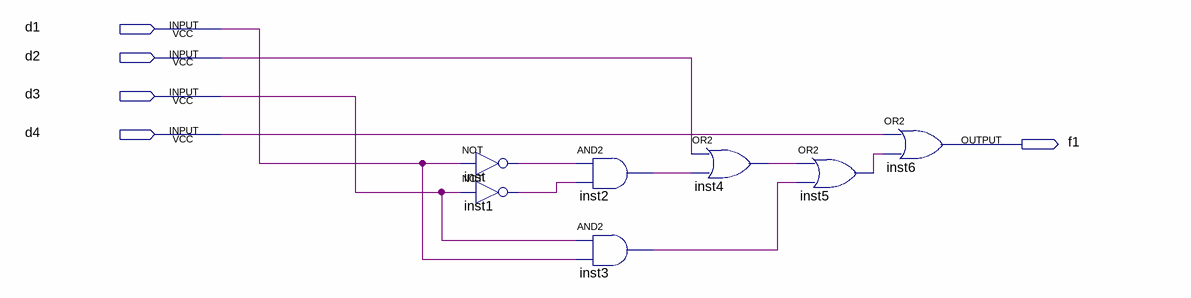
[diagram p0: schematic sheet]
// Quartus schematic f1_segment.bdf as structural Verilog: 7 symbols, 5 pins
module f1_segment (
  input  d1,
  input  d2,
  input  d3,
  input  d4,
  output f1
);

  wire inst1_out, inst2_out, inst3_out, inst4_out, inst5_out, inst_out;

  not inst (inst_out, d1);
  not inst1 (inst1_out, d3);
  and inst2 (inst2_out, inst_out, inst1_out);
  and inst3 (inst3_out, d3, d1);
  or inst4 (inst4_out, d2, inst2_out);
  or inst5 (inst5_out, inst4_out, inst3_out);
  or inst6 (f1, d4, inst5_out);
endmodule
